# Altium schematic sheet EPS_MPPT_Y_OR_Solar.SchDoc: MPPT-Y / Solar Panels ORing
size A3
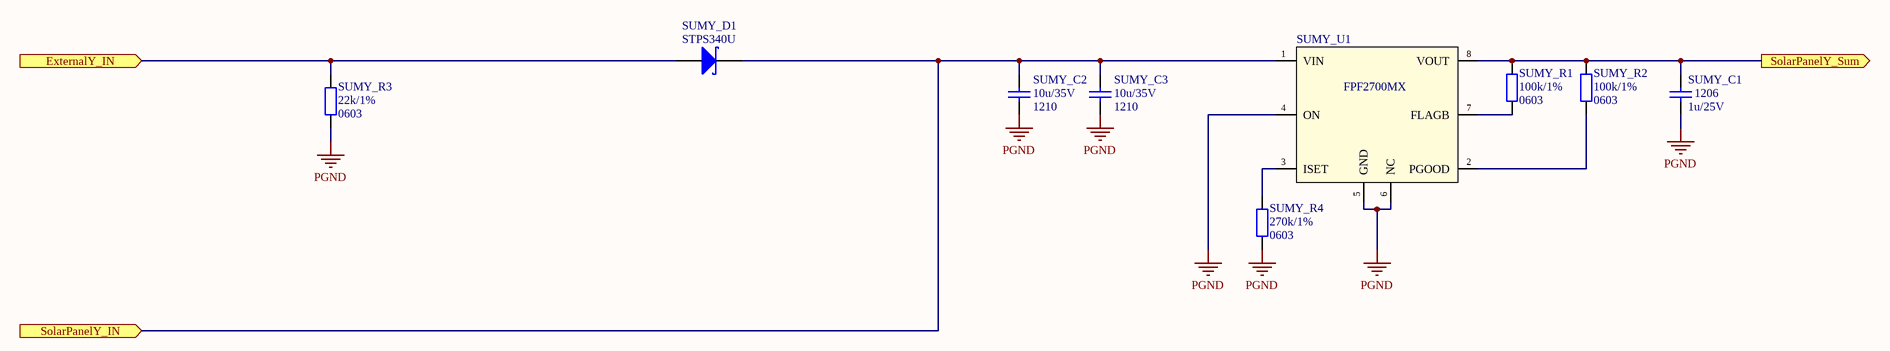
[diagram p0: EPS_MPPT_Y_OR_Solar.SchDoc]

## Parts
SUMY_C1  Package: 1206  [SMD_Capacitor_1206]  (hidden comment: 1u/25V)
SUMY_C2  Package: 1210  [SMD_Capacitor_1210]  (hidden comment: 10u/35V)
SUMY_C3  Package: 1210  [SMD_Capacitor_1210]  (hidden comment: 10u/35V)
SUMY_D1  STPS340U  [DO-214AA]
SUMY_R1  Package: 0603  [SMD_Resistor_0603]  (hidden comment: 100k/1%)
SUMY_R2  Package: 0603  [SMD_Resistor_0603]  (hidden comment: 100k/1%)
SUMY_R3  Package: 0603  [SMD_Resistor_0603]  (hidden comment: 22k/1%)
SUMY_R4  Package: 0603  [SMD_Resistor_0603]  (hidden comment: 270k/1%)
SUMY_U1  FPF2700MX  [SOIC-8-N]

## Ports
ExternalY_IN (in), SolarPanelY_IN (in), SolarPanelY_Sum (out)

## Nets
PGND: SUMY_C1.2 SUMY_C2.2 SUMY_C3.2 SUMY_R3.2 SUMY_R4.2 SUMY_U1.4(ON) SUMY_U1.5(GND) SUMY_U1.6(NC)
ExternalY_IN: SUMY_D1.A SUMY_R3.1 ; port ExternalY_IN
SolarPanelY_IN: SUMY_C2.1 SUMY_C3.1 SUMY_D1.K SUMY_U1.1(VIN) ; port SolarPanelY_IN
SolarPanelY_Sum: SUMY_C1.1 SUMY_R1.1 SUMY_R2.1 SUMY_U1.8(VOUT) ; port SolarPanelY_Sum
NetSUMY_R1_2: SUMY_R1.2 SUMY_U1.7(FLAGB)
NetSUMY_R2_2: SUMY_R2.2 SUMY_U1.2(PGOOD)
NetSUMY_R4_1: SUMY_R4.1 SUMY_U1.3(ISET)

## Notes on the sheet
- Title:
- Project:
- Author:
- Model:
- Document Number:
- Checked by:
- Rev:
- Date:
- Approved by:
- Sheet:
- of
- File name:

## Library data of the parts
SUMY_C1 = Cer_C1206T105K3RALTU: Ceramic Cap Kemet COTS 1u/25V X7R 1206; ManufacturerPartNumber: C1206T105K3RALTU; Manufacturer: Kemet; Value: 1u/25V
SUMY_C2 SUMY_C3 = Cer_GCM32EC7YA106KA03K: Ceramic Cap Murata Automotive 10u/35V X7S 1210; Manufacturer: Murata; ManufacturerPartNumber: GCM32EC7YA106KA03K; Value: 10u/35V
SUMY_D1 = STPS340x: 3A/40V Power Schottky Rectifier.; Manufacturer: STMicroelectronics; Value: STPS340U
SUMY_R1-SUMY_R4 = Res
  SUMY_R1 SUMY_R2: Value: 100k/1%
  SUMY_R3: Value: 22k/1%
  SUMY_R4: Value: 270k/1%
SUMY_U1 = FPF2700MX: Adj over-current protection 0.4-2A, Load Switch; Manufacturer: Fairchild Semiconductor; Value: FPF2700MX